# EAGLE design 808_Kick (EAGLE 7.3.0)
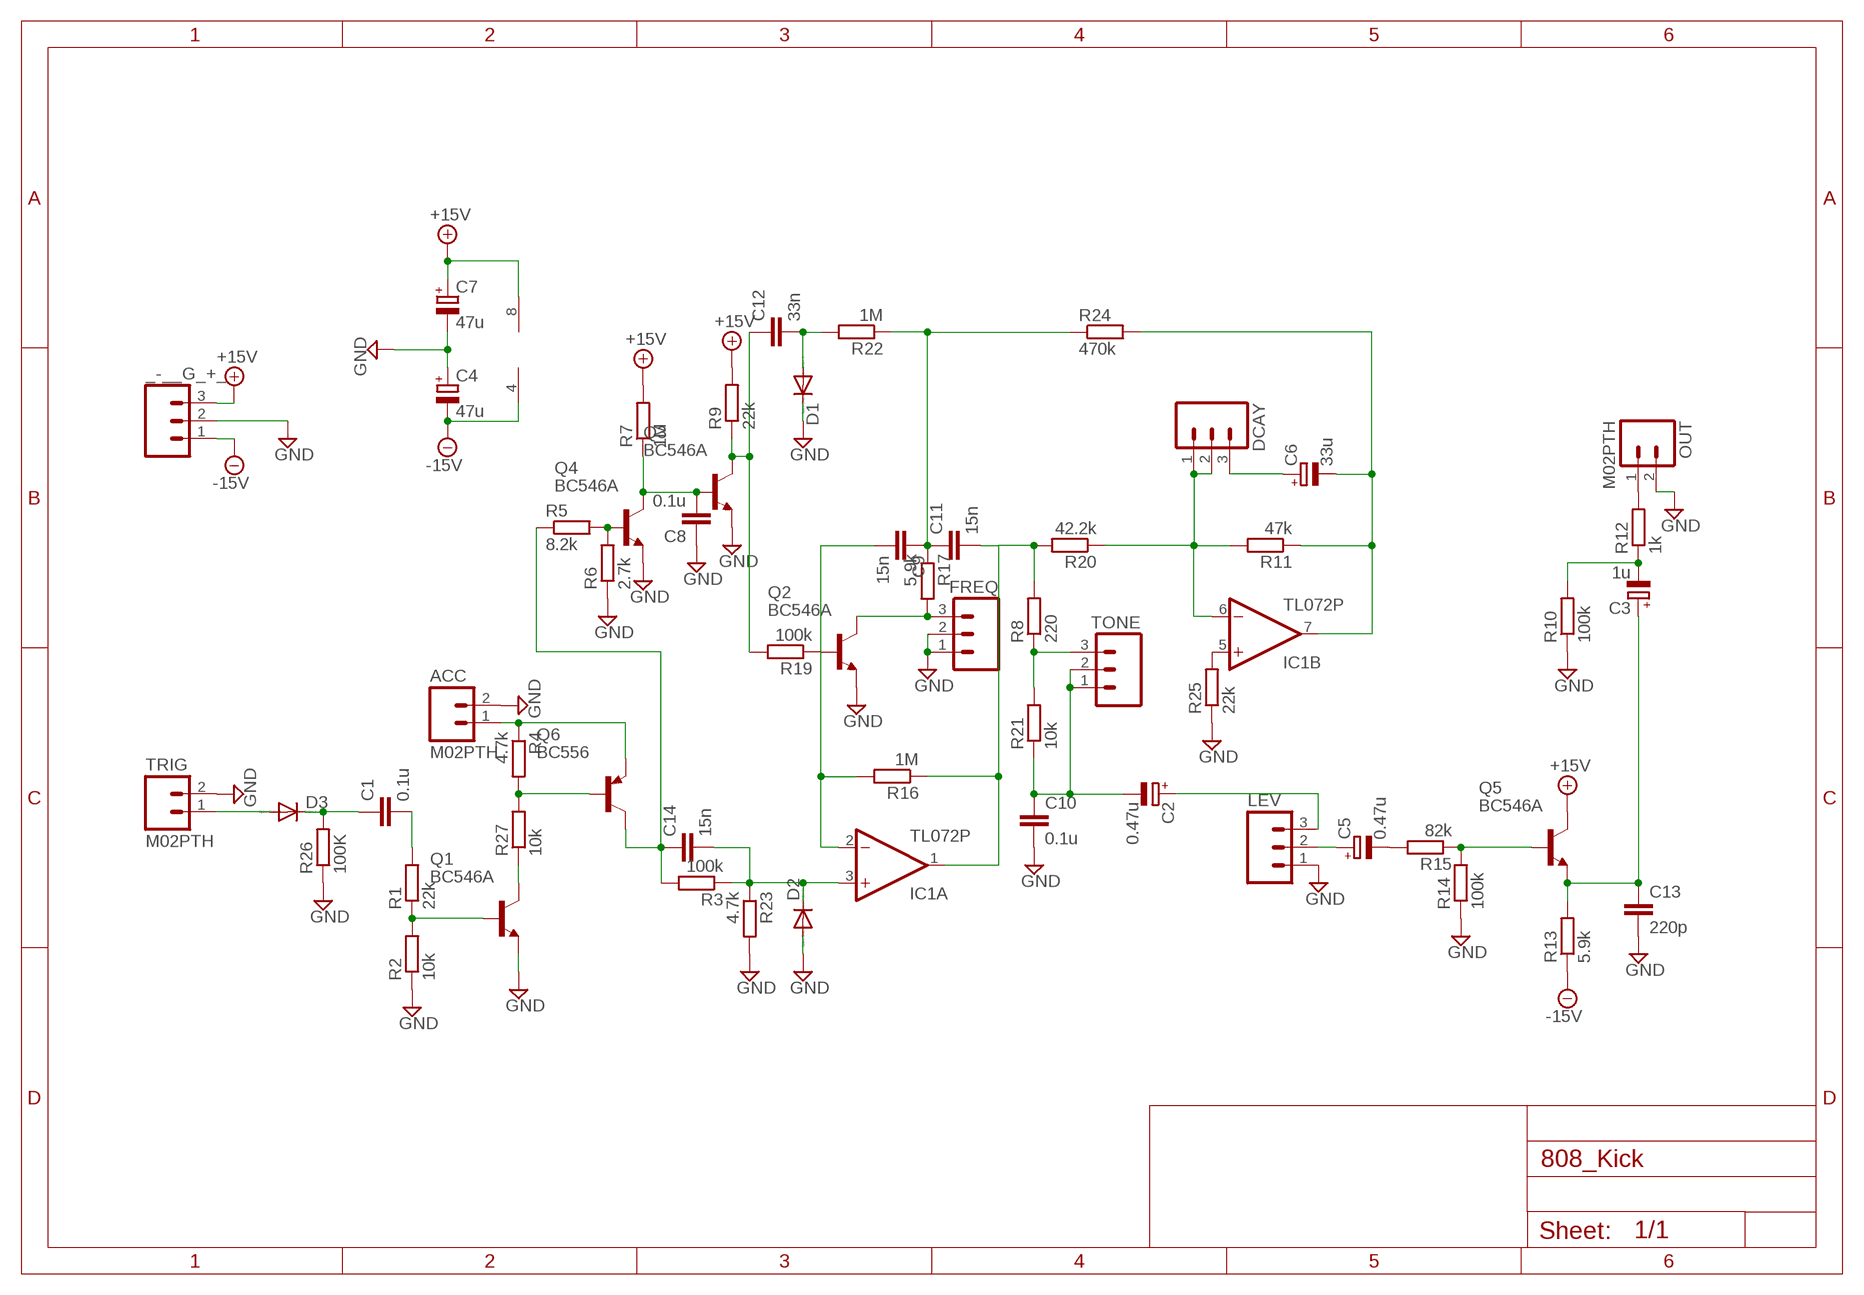
[diagram p0: schematic, sheet 1]

## Parts
_-__G_+_  M03PTH  [1X03]
ACC  M02PTH  [1X02]
C1  0.1u  C-EU025-024X044  [C025-024X044]
C2  0.47u  CPOL-EUE2,5-6E  [E2,5-6E]
C3  1u  CPOL-EUE2,5-6E  [E2,5-6E]
C4  47u  CPOL-EUE2,5-6E  [E2,5-6E]
C5  0.47u  CPOL-EUE2,5-6E  [E2,5-6E]
C6  33u  CPOL-EUE2,5-6E  [E2,5-6E]
C7  47u  CPOL-EUE2,5-6E  [E2,5-6E]
C8  0.1u  C-EU025-024X044  [C025-024X044]
C9  15n  C-EU025-024X044  [C025-024X044]
C10  0.1u  C-EU025-024X044  [C025-024X044]
C11  15n  C-EU025-024X044  [C025-024X044]
C12  33n  C-EU025-024X044  [C025-024X044]
C13  220p  C-EU025-024X044  [C025-024X044]
C14  15n  C-EU025-024X044  [C025-024X044]
D1  DIODE-D-2.5  [D-2.5]
D2  DIODE-D-2.5  [D-2.5]
D3  DIODE-D-2.5  [D-2.5]
DCAY  M03PTH  [1X03]
FREQ  M03PTH  [1X03]
IC1  TL072P  [DIL08]
LEV  M03PTH  [1X03]
OUT  M02PTH  [1X02]
Q1  BC546A  [TO92-EBC]
Q2  BC546A  [TO92-EBC]
Q3  BC546A  [TO92-EBC]
Q4  BC546A  [TO92-EBC]
Q5  BC546A  [TO92-EBC]
Q6  BC556  [TO92-EBC]
R1  22k  R-EU_0207/2V  [0207/2V]
R2  10k  R-EU_0207/2V  [0207/2V]
R3  100k  R-EU_0207/2V  [0207/2V]
R4  4.7k  R-EU_0207/2V  [0207/2V]
R5  8.2k  R-EU_0207/2V  [0207/2V]
R6  2.7k  R-EU_0207/2V  [0207/2V]
R7  1M  R-EU_0207/2V  [0207/2V]
R8  220  R-EU_0207/2V  [0207/2V]
R9  22k  R-EU_0207/2V  [0207/2V]
R10  100k  R-EU_0207/2V  [0207/2V]
R11  47k  R-EU_0207/2V  [0207/2V]
R12  1k  R-EU_0207/2V  [0207/2V]
R13  5.9k  R-EU_0207/2V  [0207/2V]
R14  100k  R-EU_0207/2V  [0207/2V]
R15  82k  R-EU_0207/2V  [0207/2V]
R16  1M  R-EU_0207/2V  [0207/2V]
R17  5.9k  R-EU_0207/2V  [0207/2V]
R19  100k  R-EU_0207/2V  [0207/2V]
R20  42.2k  R-EU_0207/2V  [0207/2V]
R21  10k  R-EU_0207/2V  [0207/2V]
R22  1M  R-EU_0207/2V  [0207/2V]
R23  4.7k  R-EU_0207/2V  [0207/2V]
R24  470k  R-EU_0207/2V  [0207/2V]
R25  22k  R-EU_0207/2V  [0207/2V]
R26  100K  R-EU_0207/2V  [0207/2V]
R27  10k  R-EU_0207/2V  [0207/2V]
TONE  M03PTH  [1X03]
TRIG  M02PTH  [1X02]

## Nets
+15V: _-__G_+_.3 C7.+ IC1.8(P:V+) Q5.C R7.2 R9.2
-15V: _-__G_+_.1 C4.- IC1.4(P:V-) R13.1
FREQ: C11.2 IC1.1(A:OUT) R8.2 R16.1 R20.2
GND: _-__G_+_.2 ACC.2 C4.+ C7.- C8.1 C10.2 C13.2 D1.C D2.A FREQ.1 FREQ.2 LEV.1 OUT.2 Q1.E Q2.E Q3.E Q4.E R2.1 R6.1 R10.1 R14.1 R23.2 R25.1 R26.1 TRIG.2
LEV: C5.+ LEV.2
N$1: Q4.B R5.2 R6.2
N$2: C8.2 Q3.B Q4.C R7.1
N$3: Q5.B R14.2 R15.1
N$4: Q2.B R19.1
N$6: IC1.5(B:+IN) R25.2
N$7: Q6.B R4.2 R27.2
N$8: C1.2 R1.2
N$9: C9.2 IC1.2(A:-IN) R16.2
N$10: C3.- R10.2 R12.1
N$11: C5.- R15.2
N$12: C9.1 C11.1 R17.1 R22.1 R24.1
N$13: OUT.1 R12.2
N$14: FREQ.3 Q2.C R17.2
N$15: C14.2 D2.C IC1.3(A:+IN) R3.1 R23.1
N$16: C14.1 Q6.C R3.2 R5.1
N$18: ACC.1 Q6.E R4.1
N$19: C3.+ C13.1 Q5.E R13.2
N$21: C2.+ LEV.3
N$22: C6.- IC1.7(B:OUT) R11.1 R24.2
N$23: Q1.C R27.1
N$24: C6.+ DCAY.3
N$25: DCAY.1 DCAY.2 IC1.6(B:-IN) R11.2 R20.1
N$26: R8.1 R21.2 TONE.3
N$27: Q1.B R1.1 R2.2
N$28: C2.- C10.1 R21.1 TONE.1 TONE.2
N$29: C12.1 Q3.C R9.1 R19.2
N$32: C12.2 D1.A R22.2
N$33: C1.1 D3.C R26.2
N$34: D3.A TRIG.1

## Library data of the parts
_-__G_+_ DCAY FREQ LEV TONE = SparkFun-Connectors:M03: Header 3 Standard 3-pin 0.1" header. Use with straight break away headers (SKU : PRT-00116), right angle break away headers (PRT-00553), swiss pins (PRT-00743), machine pins (PRT-00117), and female headers (PRT-00115). Molex polarized connector foot print use with SKU : PRT-08232 with associated crimp pins and housings.
ACC OUT TRIG = SparkFun-Connectors:M02: Standard 2-pin 0.1" header. Use with - straight break away headers ( PRT-00116) - right angle break away headers (PRT-00553) - swiss pins (PRT-00743) - machine pins (PRT-00117) - female headers (PRT-00115) Molex polarized connector foot print use with: PRT-08233 with associated crimp pins and housings. 2.54_SCREWTERM for use with PRT-10571. 3.5mm Screw Terminal footprints for PRT-08084 5mm Screw Terminal footprints for use with PRT-08432
C1 C8-C14 = rcl:C-EU: CAPACITOR, European symbol
C2-C7 = rcl:CPOL-EU: POLARIZED CAPACITOR, European symbol
D1-D3 = diode:DIODE-: DIODE
IC1 = linear:TL072: OP AMP
Q1-Q5 = transistor-npn:BC546*: NPN Transistor
Q6 = transistor-pnp:BC556*: PNP Transistror
R1-R17 R19-R27 = rcl:R-EU_: RESISTOR, European symbol

## Net classes
0 default: width 0.203 mm, clearance 0.254 mm

## Board
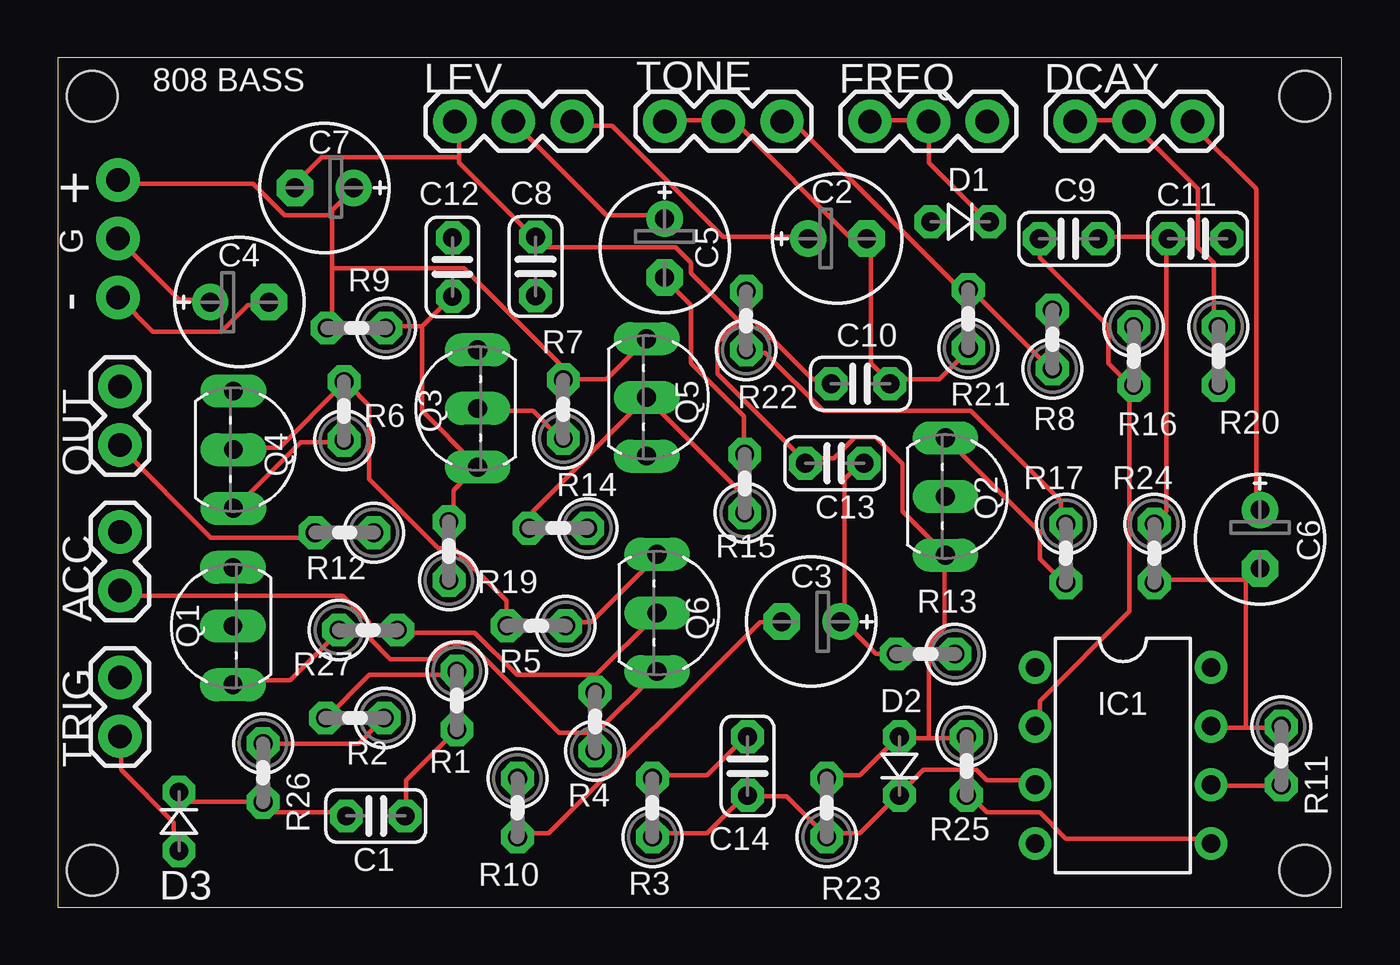
[diagram p1: board, top side]
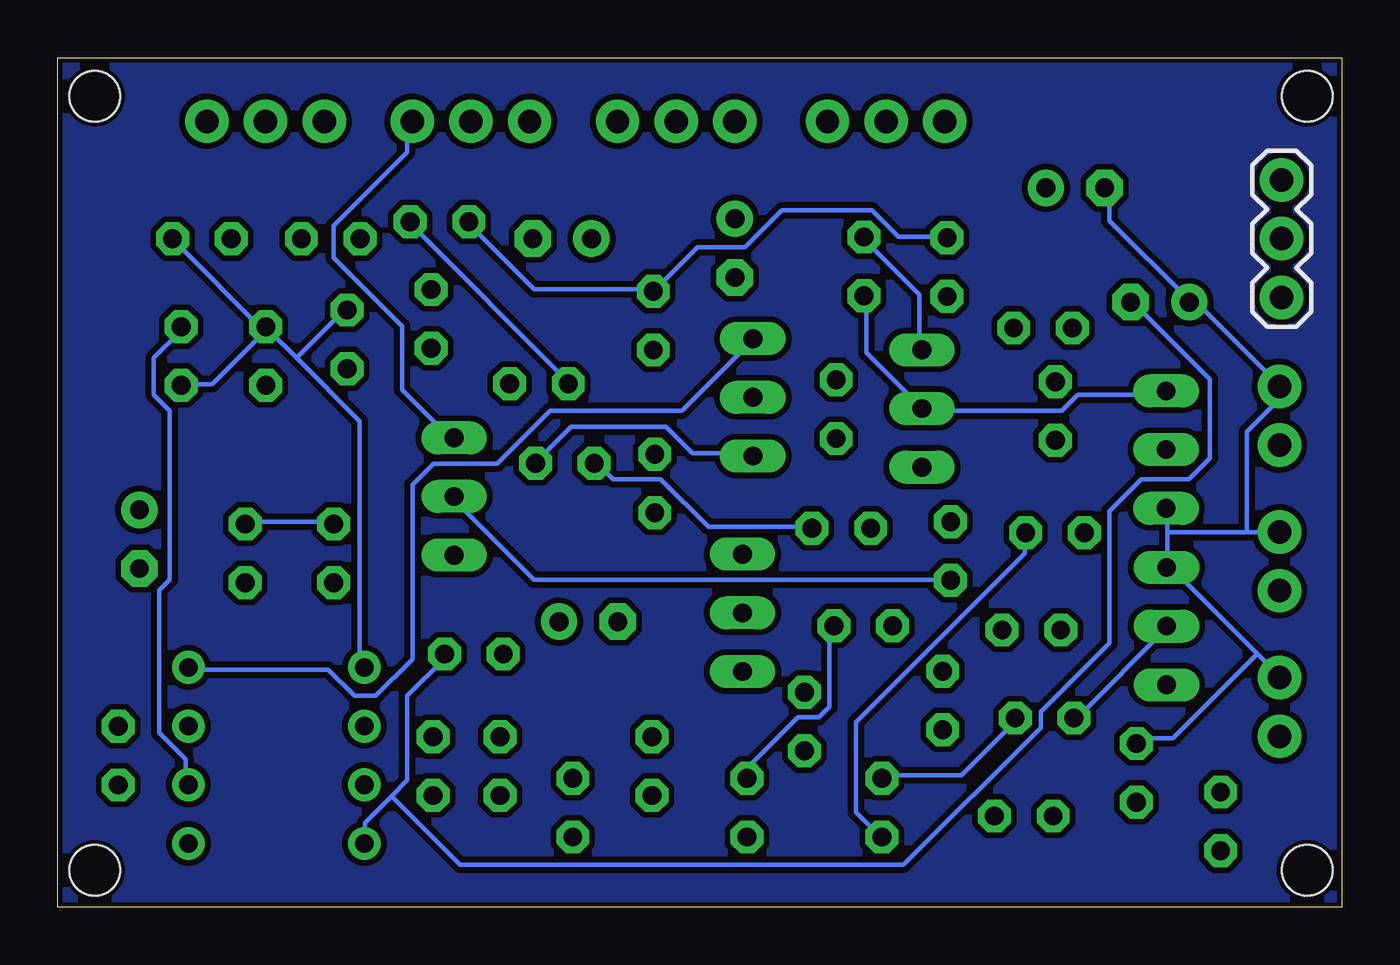
[diagram p2: board, bottom side, seen from below]

Size 55.6 x 36.77 mm. Coordinates in mm from the lower left corner, seen from the top.
Outline: 0,0 55.6,0 55.6,36.77 0,36.77 0,0
Copper layers (1*16): Top 0.035mm / dielectric 1.5mm / Bottom 0.035mm
Design rules "SparkFun": minimum track width 8mil, minimum drill 20mil, track to track 8mil, track to pad 8mil, pad to pad 8mil, via to via 8mil, smd to smd 8mil, copper to edge 8mil, drill to drill 8mil, minimum pad ring 12mil, minimum via ring 10mil, stop-mask expansion 4mil, vias tented up to drill 20mil, thermal gap 10mil
Holes 2.2 mm at 1.5,1.6 1.5,35.1 54,35.1 54,1.6

### Footprints (pad centres in the part's own frame; a part is rotated, then mirrored left to right if it is on the bottom)
1X03 = drill 1.016 pad 1.88: 1 0,0; 2 2.54,0; 3 5.08,0
1X02 = drill 1.016 pad 1.88: 1 0,0; 2 2.54,0
C025-024X044 = drill 0.813 octagon: 1 -1.27,0; 2 1.27,0
E2,5-6E = drill 0.813 pad 1.575: + -1.27,0 | drill 0.813 pad 1.575 octagon: - 1.27,0
D-2.5 = drill 0.813 octagon: A 1.27,0; C -1.27,0
DIL08 = drill 0.813 pad 1.27: 1 -3.81,-3.81; 2 -1.27,-3.81; 3 1.27,-3.81; 4 3.81,-3.81; 5 3.81,3.81; 6 1.27,3.81; 7 -1.27,3.81; 8 -3.81,3.81
TO92-EBC = drill 0.813 long: B 0,-1.27; C -2.54,-1.27; E 2.54,-1.27
0207/2V = drill 0.813 octagon: 1 -1.27,0; 2 1.27,0

### Placement (x,y rotation side)
_-__G_+_  2.6,26.4 90 bottom
ACC  2.7,13.7 90 top
C1  13.77,3.95 0 top
C2  33.76,28.94 0 top
C3  32.62,12.36 180 top
C4  7.87,26.19 0 top
C5  26.28,28.53 270 top
C6  52.06,15.93 270 top
C7  11.54,31.14 180 top
C8  20.69,27.74 270 top
C9  43.78,28.94 180 top
C10  34.76,22.66 180 top
C11  49.36,28.94 0 top
C12  17.09,27.71 90 top
C13  33.64,19.22 180 top
C14  29.87,6.11 270 top
D1  39.07,29.67 180 top
D2  36.45,6.11 90 top
D3  5.25,3.72 270 top
DCAY  44.06,34.02 0 top
FREQ  35.17,34.02 0 top
IC1  46.13,6.57 270 top
LEV  17.19,34.02 0 top
OUT  2.7,20 90 top
Q1  6.32,12.17 90 top
Q2  39.71,17.78 270 top
Q3  16.91,21.59 90 top
Q4  8.88,19.81 270 top
Q5  26.77,22.07 270 top
Q6  27.22,12.74 270 top
R1  17.28,8.95 270 top
R2  12.87,8.19 180 top
R3  25.75,4.31 90 top
R4  23.27,8.04 90 top
R5  20.72,12.18 180 top
R6  12.4,21.48 90 top
R7  21.89,21.56 90 top
R8  43.07,24.58 90 top
R9  12.94,25.07 180 top
R10  19.91,4.31 270 top
R11  52.98,6.56 270 top
R12  12.42,16.21 180 top
R13  37.58,10.96 180 top
R14  21.67,16.41 180 top
R15  29.75,18.34 90 top
R16  46.59,23.86 270 top
R17  43.65,15.32 270 top
R19  16.94,15.42 90 top
R20  50.26,23.86 270 top
R21  39.43,25.47 90 top
R22  29.81,25.39 90 top
R23  33.3,4.31 90 top
R24  47.48,15.32 270 top
R25  39.35,6.11 270 top
R26  8.89,5.82 270 top
R27  13.44,12 0 top
TONE  26.28,34.02 0 top
TRIG  2.7,7.4 90 top

### Tracks (layer width: path | path; a pad name or v marks a point on that pad's centre or on a via)
+15V
  Top 0.203: 11.89,29.95 11.89,30.18 12.8,31.09 C7.+ | 11.89,29.95 11.89,27.66 | 11.89,27.66 11.89,25.15 R9.2 | 11.89,29.95 9.83,29.95 8.46,31.32 2.74,31.32 _-__G_+_.3 | Q5.C 25.38,24.46 23.77,22.86 21.95,22.86 R7.2 21.72,22.86 21.72,23.55 17.6,27.66 11.89,27.66
  Bottom 0.203: IC1.8 49.84,10.29 43.89,10.29 42.75,9.14 41.83,9.14 40.23,10.74 40.23,18.29 39.32,19.2 36.58,19.2 34.29,21.49 28.57,21.49 25.6,24.46 Q5.C
-15V
  Top 0.203: C4.- 8.91,26.06 8.23,26.06 7.09,24.92 4.12,24.92 2.74,26.29 _-__G_+_.1
  Bottom 0.203: 41.15,4.8 40.46,5.49 40.46,9.14 38.86,10.74 R13.1 | 41.15,4.8 42.29,3.66 42.29,2.97 IC1.4 | 41.15,4.8 38.18,1.83 18.97,1.83 13.03,7.77 13.03,8.46 10.06,11.43 10.06,17.14 8.69,18.52 6.63,18.52 5.71,19.43 5.71,22.86 8.91,26.06 C4.-
FREQ
  Bottom 0.203: 45.26,23.77 46.41,24.92 R16.1 46.63,24.92 | 45.26,23.77 42.52,21.03 42.52,10.52 IC1.1 | 46.63,24.92 48.92,22.63 50.06,22.63 R20.2 | 45.26,23.77 43.2,25.83 R8.2 | 46.63,24.92 50.52,28.8 C11.2
GND
  Top 0.203: FREQ.1 35.2,34.06 37.49,34.06 FREQ.2 37.72,33.83 37.72,32.23 40.23,29.72 D1.C | R23.2 33.38,5.71 34.75,5.71 36.35,7.32 D2.A 36.58,7.32 37.72,7.32 | 37.72,7.32 39.32,7.32 R25.1 | 37.72,7.32 37.72,11.43 38.41,12.12 38.41,15.09 Q2.E 38.41,15.32 36.58,17.14 36.58,19.2 35.43,20.34 34.52,20.34 33.6,19.43 32.46,19.43 C13.2 32.23,19.43 28.57,23.09 28.57,24.46 29.49,25.38 | 29.49,25.38 30.18,25.38 32.69,22.86 33.38,22.86 C10.2 | 17.37,32.46 17.37,32.23 20.57,29.03 C8.1 20.8,28.8 21.03,28.57 26.75,28.57 27.43,27.89 27.43,27.43 29.49,25.38 | 17.37,32.46 17.37,33.83 LEV.1 | C4.+ 6.4,26.29 5.26,26.29 2.74,28.8 _-__G_+_.2 | 17.37,32.46 11.43,32.46 10.29,31.32 C7.- | R26.1 8.91,7.09 13.03,7.09 13.95,8 R2.1 | R6.1 12.34,20.12 10.52,20.12 7.77,17.37 Q4.E
  Bottom 0.203: C10.2 33.6,22.86 40.23,29.49 D1.C | R14.1 23.09,16.46 27.43,16.46 29.49,18.52 31.55,18.52 32.23,19.2 C13.2 | Q3.E 18.29,24.23 18.29,26.52 20.57,28.8 C8.1 | C7.- 10.06,31.09 10.06,29.72 6.63,26.29 C4.+ 6.4,26.29 2.74,22.63 OUT.2 2.74,22.4 2.74,21.95 4.12,20.57 4.12,16.23 | R10.1 19.89,5.71 16.46,5.71 14.17,8 R2.1 | 7.54,16.23 7.54,17.14 Q4.E | 7.54,16.23 7.54,14.86 | 7.54,14.86 3.66,10.97 | 3.66,10.97 2.74,10.06 TRIG.2 | 7.54,14.86 Q1.E | 7.54,16.23 4.12,16.23 | 4.12,16.23 2.74,16.23 ACC.2 | 3.66,10.97 7.32,7.32 8.69,7.32 R26.1
LEV
  Top 0.203: C5.+ 26.06,29.95 23.77,29.95 19.89,33.83 LEV.2
N$1
  Top 0.203: R5.2 19.43,12.34 19.43,13.26 17.14,15.54 16.46,15.54 13.49,18.52 13.49,21.72 12.57,22.63 R6.2 12.34,22.63 9.6,19.89 7.77,19.89 Q4.B
N$2
  Top 0.203: Q3.B 18.29,21.49 20.57,21.49 21.72,20.34 R7.1
  Bottom 0.203: Q4.C 7.77,22.17 11.43,22.17 12.12,21.49 18.06,21.49 Q3.B 18.29,21.72 20.57,24 20.57,26.29 C8.2
N$3
  Top 0.203: R14.2 20.57,16.46 20.57,17.14 25.38,21.95 Q5.B 25.6,21.95 29.72,17.83 29.72,17.14 R15.1
N$4
  Bottom 0.203: R19.1 17.14,14.17 34.98,14.17 38.41,17.6 Q2.B
N$5
  pour Bottom: 0,0 0,36.8 55.6,36.8 55.6,36.7 55.6,0
N$6
  Top 0.203: IC1.5 49.84,2.97 43.66,2.97 42.52,4.12 40.23,4.12 39.55,4.8 R25.2
N$7
  Top 0.203: 23.32,10.06 23.32,9.37 R4.2 | 23.32,10.06 25.83,12.57 Q6.B | 23.32,10.06 19.89,10.06 18.06,11.89 14.86,11.89 R27.2
N$8
  Top 0.203: C1.2 15.09,4.12 15.09,5.49 17.14,7.54 R1.2
N$9
  Top 0.203: IC1.2 42.52,8 42.52,8.91 46.41,12.8 46.41,22.4 R16.2 46.41,22.63 45.49,23.55 45.49,25.15 42.52,28.12 42.52,28.8 C9.2
N$10
  Top 0.203: C3.- 31.32,12.34 30.4,12.34 21.26,3.2 20.12,3.2 R10.2
  Bottom 0.203: R12.1 13.72,16 13.72,15.32 21.03,8 21.03,4.12 20.12,3.2 R10.2
N$11
  Top 0.203: R15.2 29.72,19.66 29.72,21.26 27.43,23.55 27.43,26.06 26.29,27.2 C5.-
N$12
  Top 0.203: C9.1 45.26,29.03 48.01,29.03 C11.1 | 48.23,29.03 C11.1 | R22.1 29.95,24 30.63,24 33.15,21.49 39.55,21.49 43.43,17.6 43.43,16.69 R17.1 | C11.1 48.01,28.8 48.01,17.14 47.55,16.69 R24.1
  Bottom 0.203: R17.1 43.66,16.69 47.32,16.69 R24.1
N$13
  Top 0.203: R12.2 10.97,16 6.63,16 2.74,19.89 OUT.1
N$14
  Top 0.203: Q2.C 38.63,20.12 42.52,16.23 42.52,15.09 43.43,14.17 R17.2
  Bottom 0.203: FREQ.3 40.46,33.83 40.46,32.69 43.66,29.49 43.66,28.12 40.69,25.15 40.69,22.4 38.63,20.34 Q2.C
N$15
  Top 0.203: R3.1 25.83,3.2 28.12,3.2 29.72,4.8 C14.2 29.95,4.8 31.55,4.8 33.15,3.2 R23.1 33.38,3.2 34.75,3.2 36.35,4.8 D2.C 36.58,5.03 37.49,5.94 39.78,5.94 40.23,5.49 42.29,5.49 IC1.3
N$16
  Top 0.203: R3.2 25.83,5.71 28.12,5.71 29.72,7.32 C14.1 | R5.1 22.17,12.34 23.09,12.34 25.83,15.09 Q6.C
  Bottom 0.203: R3.2 25.6,5.71 25.6,6.17 23.55,8.23 22.63,8.23 22.17,8.69 22.17,12.12 R5.1
N$18
  Top 0.203: 23.32,7.54 23.32,6.86 R4.1 | 23.32,7.54 25.83,10.06 Q6.E | 23.32,7.54 21.72,7.54 17.83,11.43 16.92,11.43 16.23,10.74 14.4,10.74 13.49,11.66 13.49,12.34 12.34,13.49 2.74,13.49 ACC.1
N$19
  Top 0.203: R13.2 36.12,10.97 35.43,10.97 34.06,12.34 C3.+ 34.06,12.57 34.06,18.52 34.75,19.2 C13.1
  Bottom 0.203: Q5.E 25.6,19.66 28.12,19.66 29.26,20.8 33.38,20.8 34.75,19.43 C13.1
N$21
  Top 0.203: C2.+ 32.46,29.03 28.8,29.03 24,33.83 22.4,33.83 LEV.3
N$22
  Top 0.203: 51.44,7.77 52.81,7.77 R11.1 | 51.44,7.77 50.06,7.77 IC1.7 | 51.44,14.17 47.55,14.17 R24.2 | 51.44,14.17 51.89,14.63 C6.- 51.44,14.17 | 51.44,14.17 51.44,7.77
N$23
  Top 0.203: Q1.C 7.77,9.83 10.06,9.83 12.12,11.89 R27.1
N$24
  Top 0.203: C6.+ 51.89,17.37 51.89,31.09 49.15,33.83 DCAY.3
N$25
  Top 0.203: IC1.6 50.06,5.26 52.81,5.26 R11.2 | R20.1 50.06,25.15 50.06,27.89 49.38,28.57 49.38,31.09 46.63,33.83 DCAY.2 46.41,34.06 44.12,34.06 DCAY.1
  Bottom 0.203: IC1.6 50.06,5.49 50.06,6.4 51.21,7.54 51.21,13.72 50.75,14.17 50.75,21.49 51.44,22.17 51.44,23.77 50.29,24.92 R20.1
N$26
  Top 0.203: R8.1 42.98,23.32 39.55,26.75 R21.2 39.32,26.52 32,33.83 31.55,33.83 TONE.3
N$27
  Top 0.203: R1.1 17.14,10.06 13.49,10.06 11.66,8.23 R2.2
  Bottom 0.203: R2.2 11.43,8.23 7.54,12.12 Q1.B
N$28
  Top 0.203: TONE.1 26.29,34.06 28.8,34.06 TONE.2 29.03,33.83 29.49,33.83 34.29,29.03 34.98,29.03 C2.- 35.2,28.8 35.2,23.55 35.89,22.86 C10.1 | 36.12,22.63 C10.1 | C10.1 36.12,22.86 38.18,22.86 39.32,24 R21.1
N$29
  Top 0.203: R19.2 17.14,16.92 17.14,18.06 18.06,18.97 Q3.C 18.06,19.2 15.77,21.49 15.77,25.15 | 15.77,25.15 14.4,25.15 R9.1 | 15.77,25.15 16.92,26.29 C12.1
N$32
  Bottom 0.203: D1.A 37.72,29.49 34.98,26.75 29.95,26.75 R22.2 29.72,26.75 27.89,28.57 25.83,28.57 24.23,30.18 20.34,30.18 19.2,29.03 17.14,29.03 C12.2
N$33
  Top 0.203: D3.C 5.26,4.8 5.49,4.57 8.69,4.57 R26.2 8.91,4.34 9.14,4.12 12.34,4.12 C1.1
N$34
  Top 0.203: D3.A 5.03,2.52 5.03,3.66 2.74,5.94 2.74,7.32 TRIG.1

### Text on the board
tPlace: 808 BASS | + | G | -